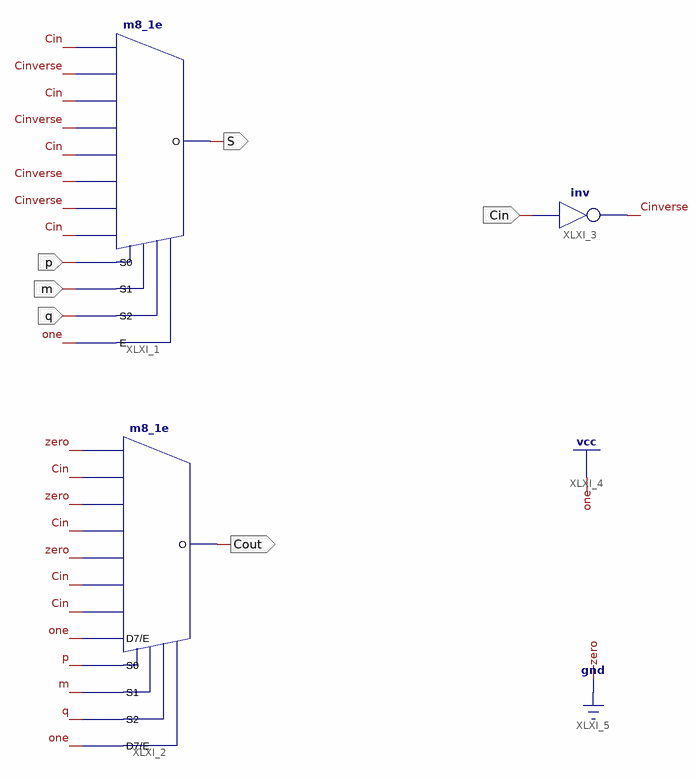
[diagram p0: schematic sheet 1]
// Xilinx ISE schematic topworld.sch (spartan3e) as structural Verilog: 3 symbols, 6 ports
module topworld (
  input  Cin,
  input  p,
  input  m,
  input  q,
  output S,
  output Cout
);

  wire Cinverse;

  m8_1e XLXI_1 (
    .D0(Cin), .D1(Cinverse), .D2(Cin), .D3(Cinverse), .D4(Cin), .D5(Cinverse), .D6(Cinverse), .D7(Cin),
    .E(1'b1), .S0(p), .S1(m), .S2(q), .O(S));
  m8_1e XLXI_2 (
    .D0(1'b0), .D1(Cin), .D2(1'b0), .D3(Cin), .D4(1'b0), .D5(Cin), .D6(Cin), .D7(1'b1), .E(1'b1), .S0(p),
    .S1(m), .S2(q), .O(Cout));
  not XLXI_3 (Cinverse, Cin);
endmodule
